# Altium project ROBOT.PrjPcb
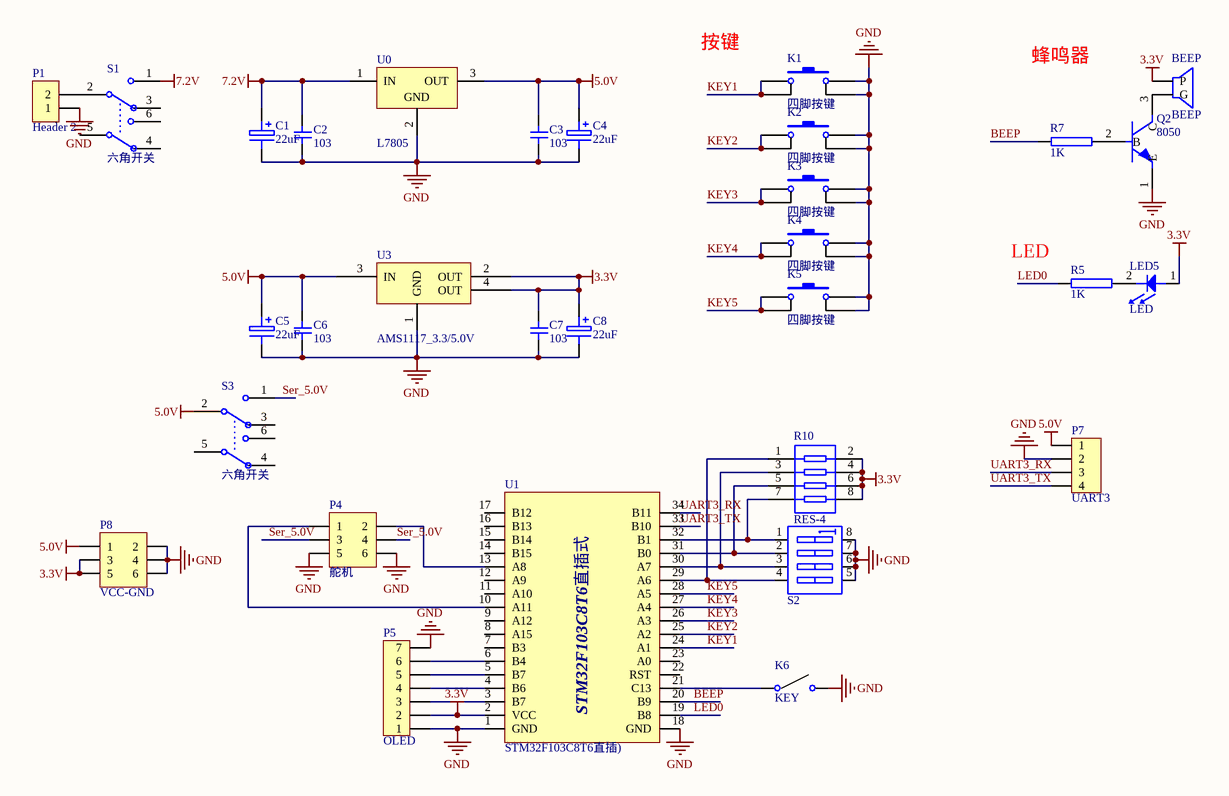
[diagram p0: ROBOT.SchDoc]
1 sheet, 31 parts. Net scope: global (net labels, ports and power ports of the same name join across sheets).
Board file: ROBOT1.PcbDoc

## Sheet ROBOT.SchDoc
size A4

### Parts
BEEP  BEEP  [BUZZER]
C1  22uF  [Cap1(47uF)]
C2  103  [0805C]
C3  103  [0805C]
C4  22uF  [Cap1(47uF)]
C5  22uF  [Cap1(47uF)]
C6  103  [0805C]
C7  103  [0805C]
C8  22uF  [Cap1(47uF)]
K1  四脚按键  [SW_PB4_DIP]
K2  四脚按键  [SW_PB4_DIP]
K3  四脚按键  [SW_PB4_DIP]
K4  四脚按键  [SW_PB4_DIP]
K5  四脚按键  [SW_PB4_DIP]
K6  KEY  [干簧管]
LED5  LED  [0805LED]
P1  Header 2  [Header 2]
P4  舵机  [Header 3X2]
P5  OLED  [Header 7]
P7  UART3  [Header 4]
P8  VCC-GND  [Header 3X2]
Q2  8050  [NPN]
R5  1K  [0805R]
R7  1K  [0805R]
R10  RES-4  [排阻(4位贴片)]
S1  六角开关  [六角开关]
S2  SWICH  [拨码开关*4]  (value not drawn)
S3  六角开关  [六角开关]
U0  L7805  [T03B]
U1  STM32F103C8T6直插)  [ST32F103C8T6直插]
U3  AMS1117_3.3/5.0V  [SOT-223]

### Nets
3.3V: BEEP.1(P) C7.2 C8.1 LED5.1 P5.2 P8.3 P8.5 R10.2 R10.4 R10.6 R10.8 U1.2(VCC) U3.2(OUT) U3.4(OUT)
5.0V: C3.2 C4.1 C5.1 C6.2 P7.1 P8.1 S3.2 U0.3(OUT) U3.3(IN)
7.2V: C1.1 C2.2 S1.1 U0.1(IN)
GND: C1.2 C2.1 C3.1 C4.2 C5.2 C6.1 C7.1 C8.2 K1.2 K1.3 K2.2 K2.3 K3.2 K3.3 K4.2 K4.3 K5.2 K5.3 K6.2 P1.1 P4.5 P4.6 P5.1 P5.7 P7.2 P8.2 P8.4 P8.6 Q2.1(E) S2.5(B4) S2.6(B3) S2.7(B2) S2.8(B1) U0.2(GND) U1.1(GND) U1.18(GND) U3.1(GND)
BEEP: R7.2 U1.20(B9)
KEY1: K1.1 K1.4 U1.24(A1)
KEY2: K2.1 K2.4 U1.25(A2)
KEY3: K3.1 K3.4 U1.26(A3)
KEY4: K4.1 K4.4 U1.27(A4)
KEY5: K5.1 K5.4 U1.28(A5)
LED0: R5.2 U1.19(B8)
Ser_5.0V: P4.3 P4.4 S3.1
UART3_RX: P7.3 U1.34(B11)
UART3_TX: P7.4 U1.33(B10)
NetBEEP_2: BEEP.2(G) Q2.3(C)
NetK6_1: K6.1 U1.21(C13)
NetLED5_2: LED5.2 R5.1
NetP1_2: P1.2 S1.2
NetP4_1: P4.1 U1.10(A11)
NetP4_2: P4.2 U1.13(A8)
NetP5_3: P5.3 U1.3(B7)
NetP5_4: P5.4 U1.4(B6)
NetP5_5: P5.5 U1.5(B7)
NetP5_6: P5.6 U1.6(B4)
NetQ2_2: Q2.2(B) R7.1
NetR10_1: R10.1 S2.4(A4) U1.29(A6)
NetR10_3: R10.3 S2.3(A3) U1.30(A7)
NetR10_5: R10.5 S2.2(A2) U1.31(B0)
NetR10_7: R10.7 S2.1(A1) U1.32(B1)

Not connected (* = marked no-connect by the designer): S1 3 4 5 6; S3 3 4 5 6; U1 7(B3) 8(A15) 9(A12) 11(A10) 12(A9) 14(B15) 15(B14) 16(B13) 17(B12) 22(RST) 23(A0)

### Notes on the sheet
- 按键
- 蜂鸣器
- (near R5) LED
- (in symbol STM32F103C8T6直插)) STM32F103C8T6直插式

### Library data of the parts
C1 C4 C5 C8 = Cap1(100uF)
C2 C3 C6 C7 = C1
K1-K5 = Key(四脚)
K6 = 干簧管
P4 P8 = Header 3X2
P5 = Header 7
P7 = Header 4
Q2 = Q2
R5 R7 = R1
S2 = 拨码开关(4位): 拨码开关（4位）
U3 = AMS1117-3.3V/5.0V